# EAGLE design Debug-unit (rev01) (EAGLE 6.6.0)

## Sheet 1 of 2
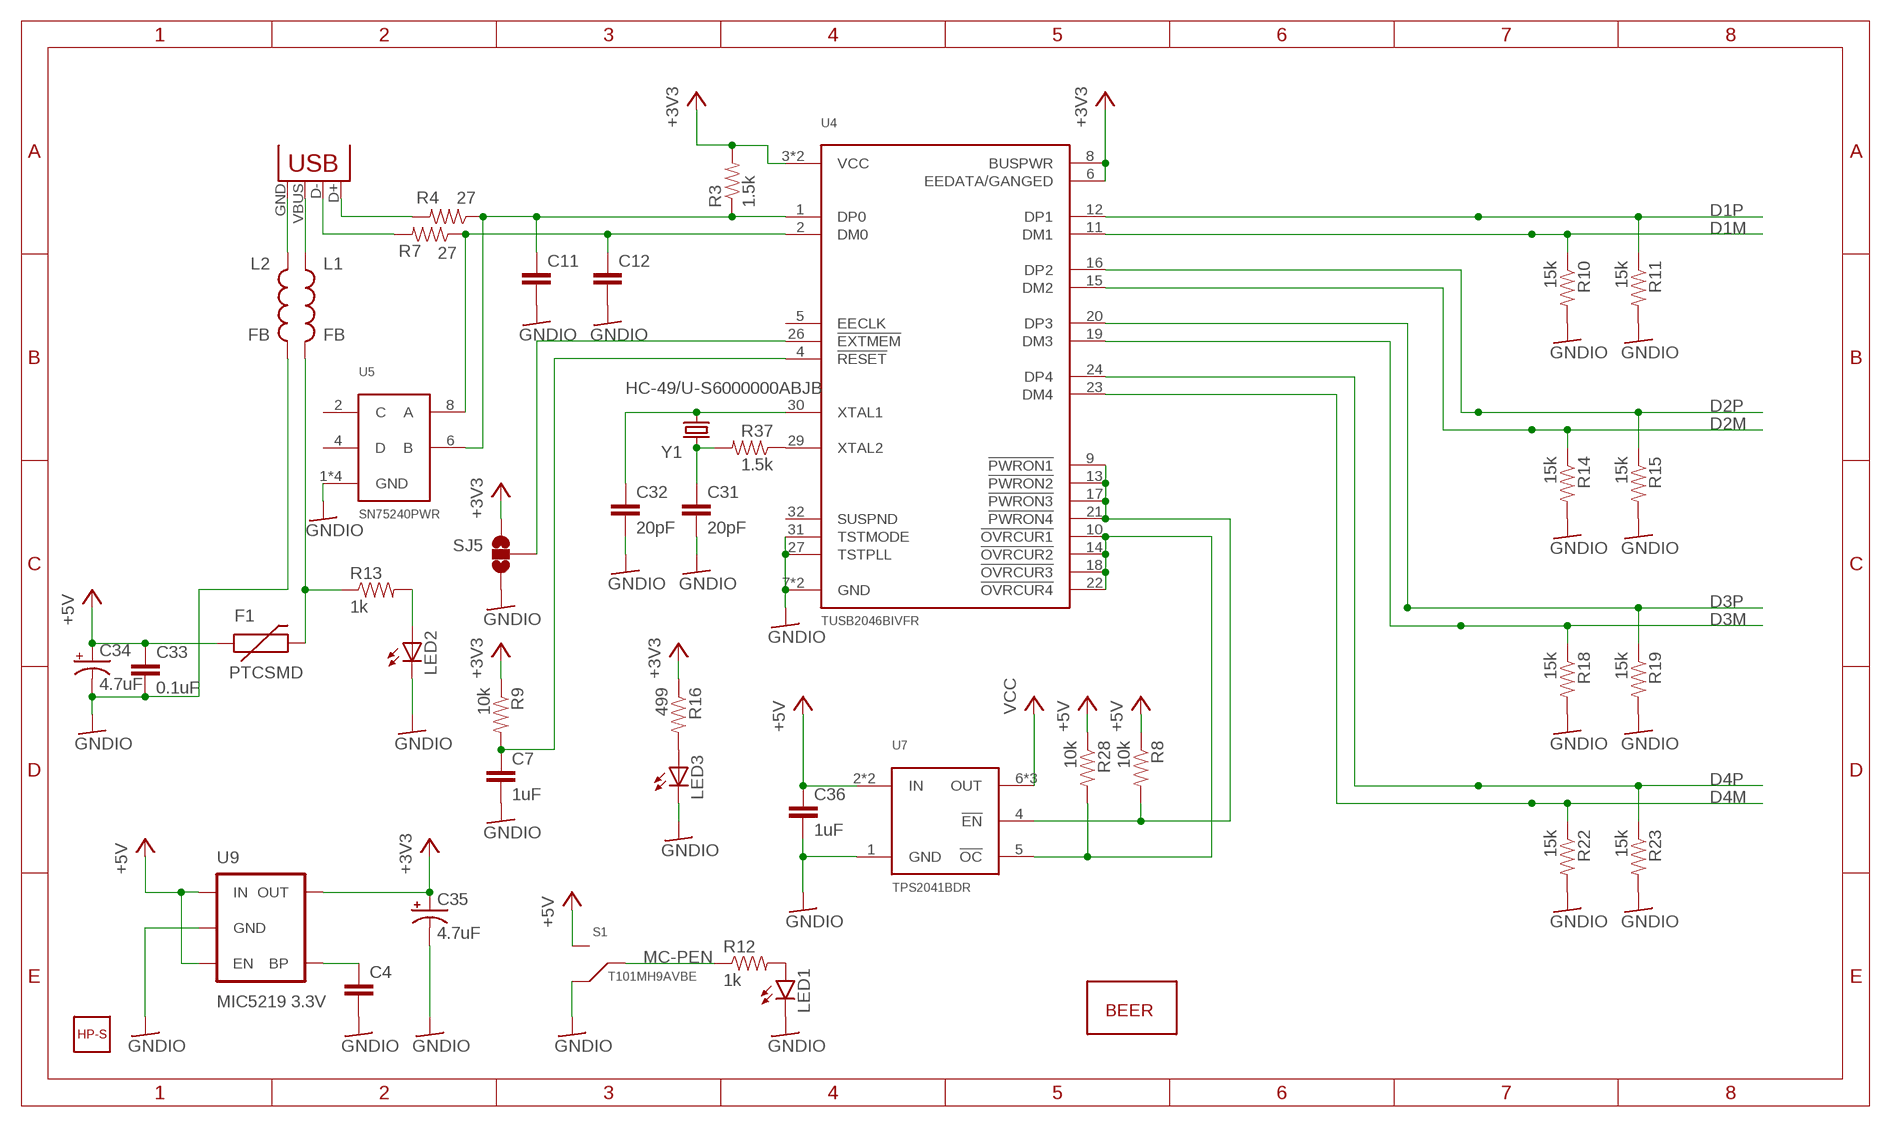
[diagram p0: schematic, sheet 1]

### Parts
C4  CAP0805  [0805]
C7  1uF  CAP0805  [0805]
C11  CAP0805  [0805]
C12  CAP0805  [0805]
C31  20pF  CAP0805  [0805]
C32  20pF  CAP0805  [0805]
C33  0.1uF  CAP0805  [0805]
C34  4.7uF  CAP_POL1206  [EIA3216]
C35  4.7uF  CAP_POL1206  [EIA3216]
C36  1uF  CAP0805  [0805]
F1  PTCSMD  [PTC-1206]
JP9  USB-B  USBPTH  [USB-B-PTH]
L1  FB  INDUCTOR0805  [0805]
L2  FB  INDUCTOR0805  [0805]
LED1  LED-3MM-NO_SILK  [LED3MM-NS]
LED2  LEDCHIP-LED0805  [CHIP-LED0805]
LED3  LEDCHIP-LED0805  [CHIP-LED0805]
R3  1.5k  RESISTOR0805-RES  [0805]
R4  27  RESISTOR0805-RES  [0805]
R7  27  RESISTOR0805-RES  [0805]
R8  10k  RESISTOR0805-RES  [0805]
R9  10k  RESISTOR0805-RES  [0805]
R10  15k  RESISTOR0805-RES  [0805]
R11  15k  RESISTOR0805-RES  [0805]
R12  1k  RESISTOR0805-RES  [0805]
R13  1k  RESISTOR0805-RES  [0805]
R14  15k  RESISTOR0805-RES  [0805]
R15  15k  RESISTOR0805-RES  [0805]
R16  499  RESISTOR0805-RES  [0805]
R18  15k  RESISTOR0805-RES  [0805]
R19  15k  RESISTOR0805-RES  [0805]
R22  15k  RESISTOR0805-RES  [0805]
R23  15k  RESISTOR0805-RES  [0805]
R28  10k  RESISTOR0805-RES  [0805]
R37  1.5k  RESISTOR0805-RES  [0805]
S1  T101MH9AVBE  [T101MH9AVBE]
SJ5  JUMPER-PAD-3-NOFULL_BOX_SILK  [PAD-JUMPER-3-NO_YES_SILK_FULL_BOX]
U4  TUSB2046BIVFR  [LQFP-32]
U5  SN75240PWR  [TSSOP-8]
U7  TPS2041BDR  [SO-8]
U9  MIC5219 3.3V  V_REG_MIC52193.3V  [SOT23-5]
U$1  HP-3651-B  [HP-3651-B]
U$3  BEERS  [B-S]
Y1  HC-49/U-S6000000ABJB  CRYSTALHC49US  [HC49US]

### Nets
+3V3: C35.A(+) R3.2 R9.1 R16.1 SJ5.1 U4.3(VCC) U4.6(EEDATA/GANGED) U4.8(BUSPWR) U4.25(VCC) U9.5(OUT)
+5V: C33.1 C34.A(+) C36.1 F1.1 R8.1 R28.1 S1.1(NO) U7.2(IN) U7.3(IN) U9.1(IN) U9.3(EN)
D1M: R10.1 U4.11(DM1) ; also sheet 2
D1P: R11.1 U4.12(DP1) ; also sheet 2
D2M: R14.1 U4.15(DM2) ; also sheet 2
D2P: R15.1 U4.16(DP2) ; also sheet 2
D3M: R18.1 U4.19(DM3) ; also sheet 2
D3P: R19.1 U4.20(DP3) ; also sheet 2
D4M: R22.1 U4.23(DM4) ; also sheet 2
D4P: R23.1 U4.24(DP4) ; also sheet 2
GNDIO: C4.2 C7.2 C11.2 C12.2 C31.2 C32.2 C33.2 C34.C(-) C35.C(-) C36.2 L2.2 LED1.K(C) LED2.C LED3.C R10.2 R11.2 R14.2 R15.2 R18.2 R19.2 R22.2 R23.2 S1.3(NC) SJ5.3 U4.7(GND) U4.27(TSTPLL) U4.28(GND) U4.31(TSTMODE) U5.1(GND) U5.3(GND) U5.5(GND) U5.7(GND) U7.1(GND) U9.2(GND) ; also sheet 2
MC-PEN: R12.1 S1.2(C) ; also sheet 2
N$7: C4.1 U9.4(BP)
N$11: R8.2 U4.9(!PWRON1) U4.13(!PWRON2) U4.17(!PWRON3) U4.21(!PWRON4) U7.4(!EN)
N$13: LED2.A R13.2
N$25: LED3.A R16.2
N$28: R28.2 U4.10(!OVRCUR1) U4.14(!OVRCUR2) U4.18(!OVRCUR3) U4.22(!OVRCUR4) U7.5(!OC)
N$38: R37.1 U4.29(XTAL2)
N$39: C31.1 R37.2 Y1.2
N$40: C32.1 U4.30(XTAL1) Y1.1
N$41: C11.1 R3.1 R4.1 U4.1(DP0) U5.6(B)
N$42: SJ5.2 U4.26(!EXTMEM)
N$43: C12.1 R7.1 U4.2(DM0) U5.8(A)
N$44: JP9.D+ R4.2
N$45: JP9.D- R7.2
N$46: C7.1 R9.2 U4.4(!RESET)
N$49: JP9.VBUS L1.1
N$50: JP9.GND L2.1
N$51: F1.2 L1.2 R13.1
N$52: LED1.A R12.2
VCC: U7.6(OUT) U7.7(OUT) U7.8(OUT) ; also sheet 2
Unconnected: U4.5(EECLK) U4.32(SUSPND) U5.2(C) U5.4(D)

## Sheet 2 of 2
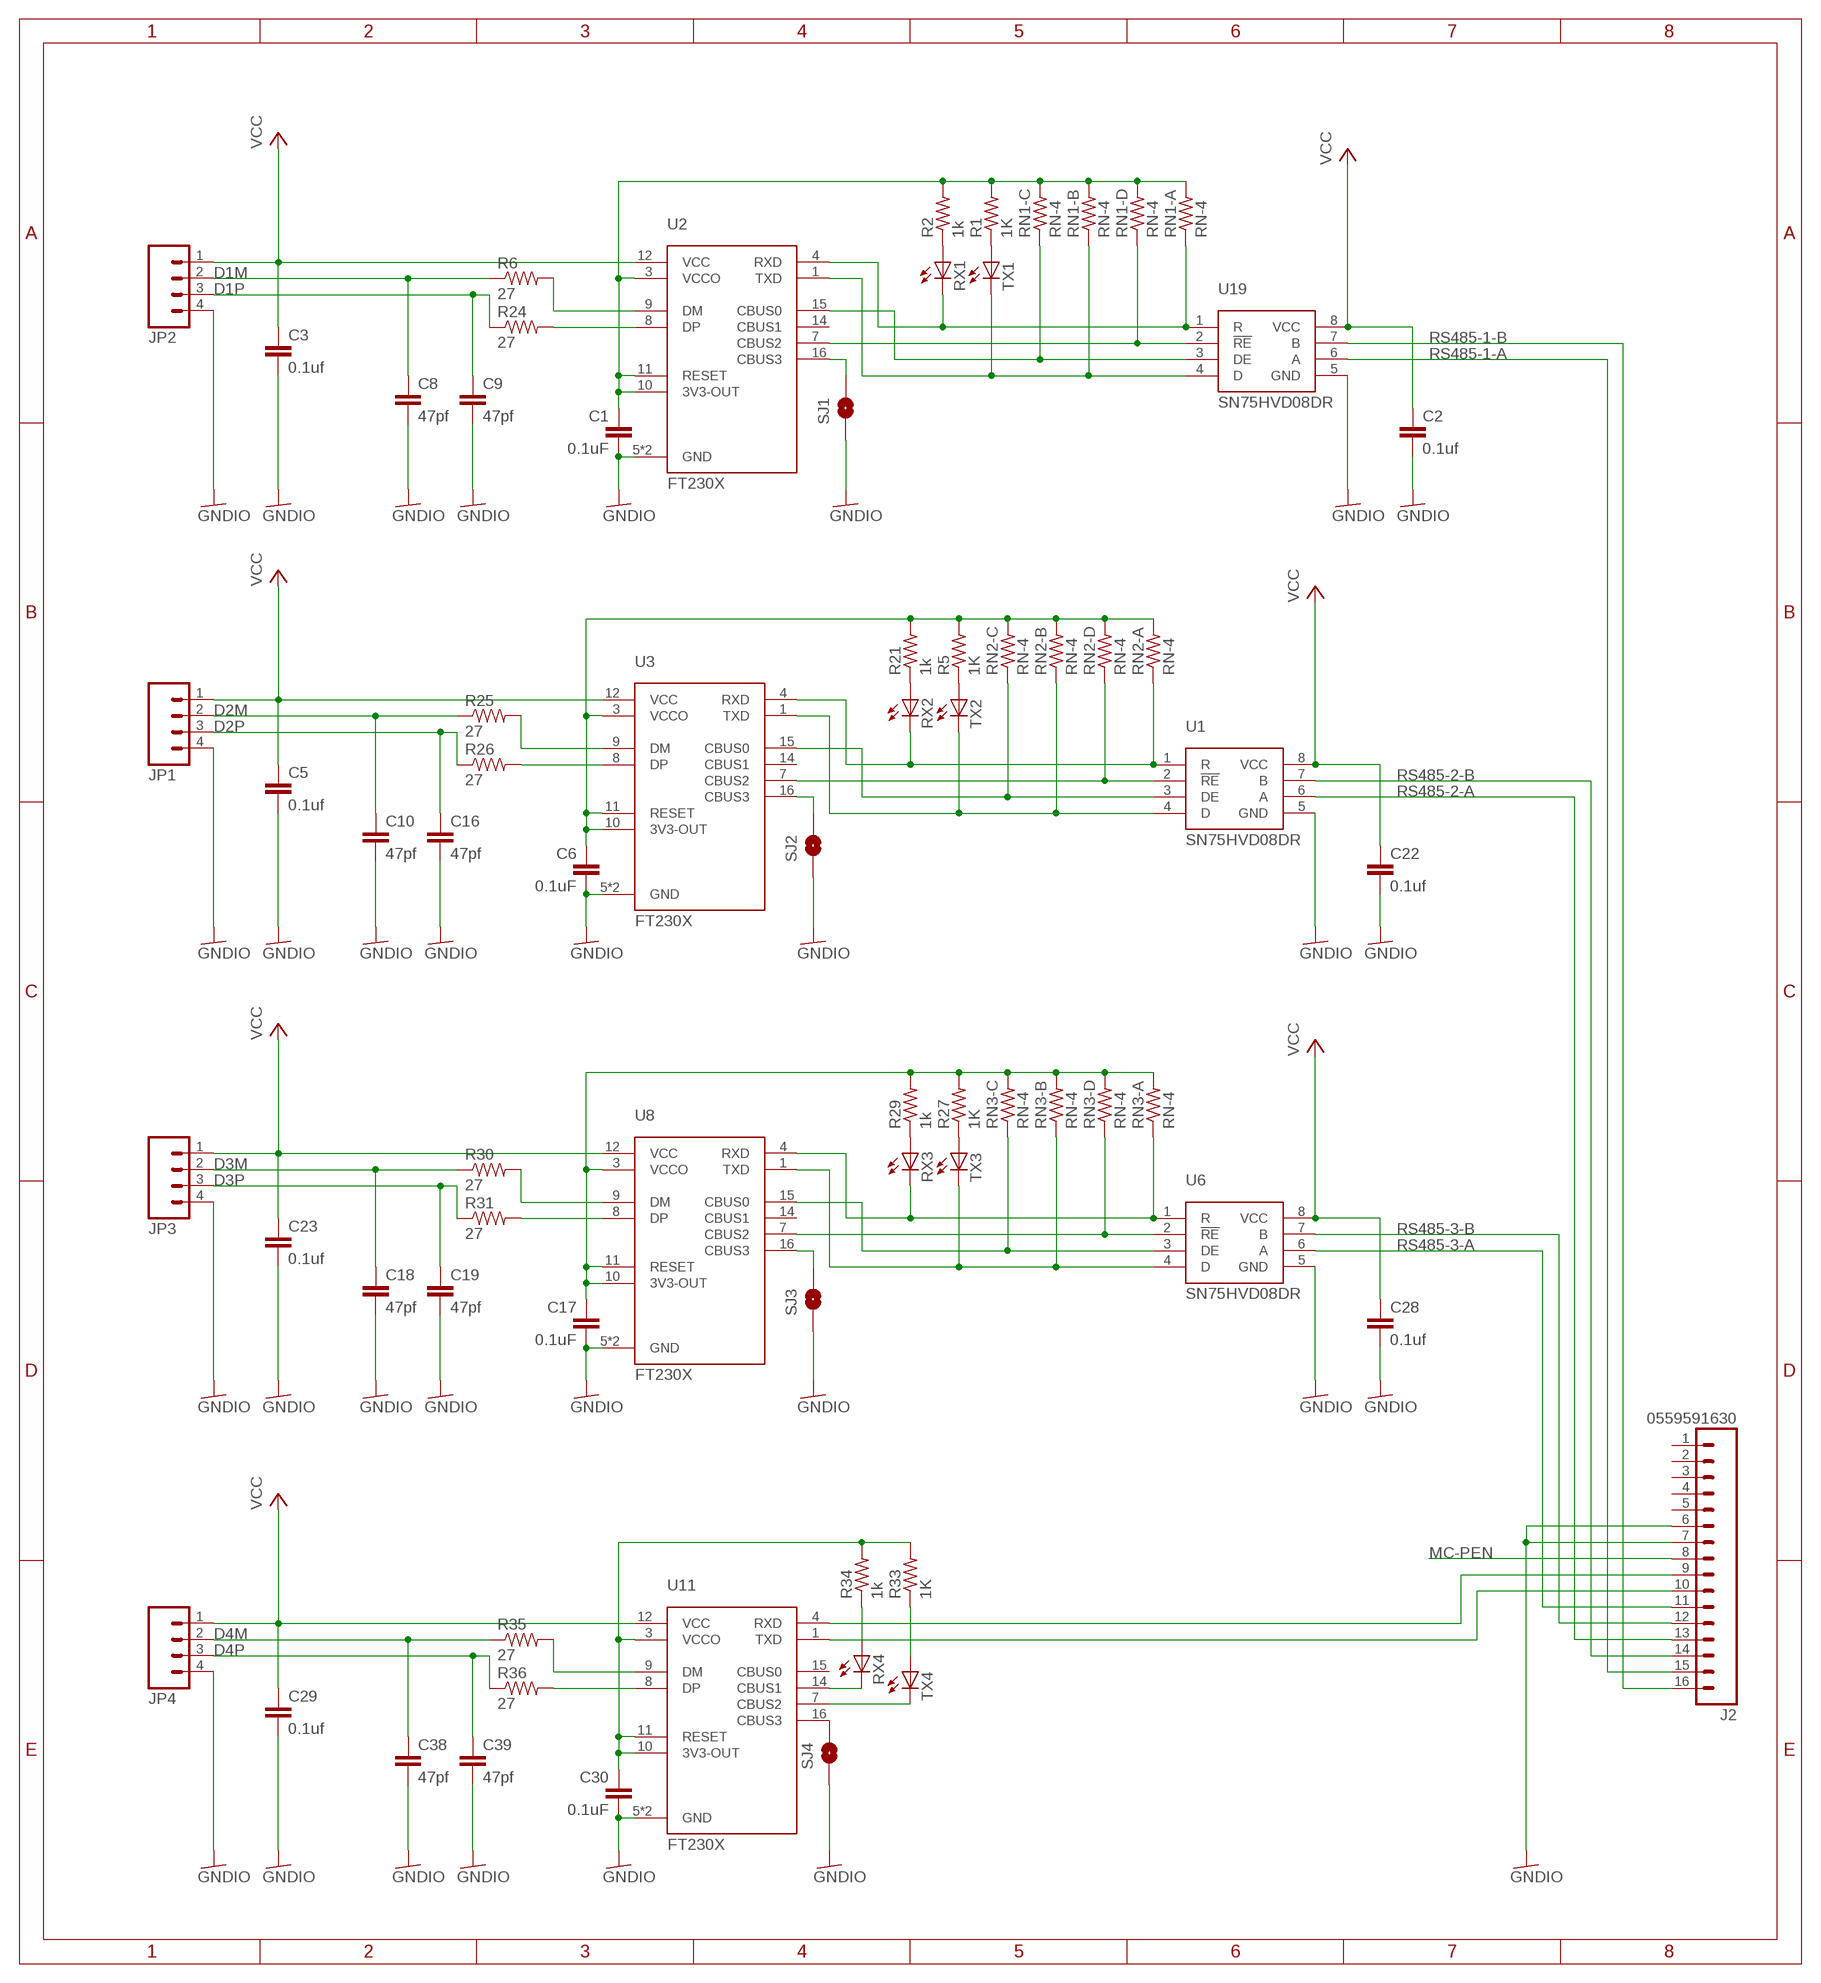
[diagram p1: schematic, sheet 2]

### Parts
C1  0.1uF  CAP0805  [0805]
C2  0.1uf  CAP0805  [0805]
C3  0.1uf  CAP0805  [0805]
C5  0.1uf  CAP0805  [0805]
C6  0.1uF  CAP0805  [0805]
C8  47pf  CAP0805  [0805]
C9  47pf  CAP0805  [0805]
C10  47pf  CAP0805  [0805]
C16  47pf  CAP0805  [0805]
C17  0.1uF  CAP0805  [0805]
C18  47pf  CAP0805  [0805]
C19  47pf  CAP0805  [0805]
C22  0.1uf  CAP0805  [0805]
C23  0.1uf  CAP0805  [0805]
C28  0.1uf  CAP0805  [0805]
C29  0.1uf  CAP0805  [0805]
C30  0.1uF  CAP0805  [0805]
C38  47pf  CAP0805  [0805]
C39  47pf  CAP0805  [0805]
J2  0559591630  [0559591630]
JP1  M04POLAR_LOCK  [MOLEX-1X4_LOCK]
JP2  M04POLAR_LOCK  [MOLEX-1X4_LOCK]
JP3  M04POLAR_LOCK  [MOLEX-1X4_LOCK]
JP4  M04POLAR_LOCK  [MOLEX-1X4_LOCK]
R1  1K  R-US_R0805  [R0805]
R2  1k  R-US_R0805  [R0805]
R5  1K  R-US_R0805  [R0805]
R6  27  RESISTOR0805-RES  [0805]
R21  1k  R-US_R0805  [R0805]
R24  27  RESISTOR0805-RES  [0805]
R25  27  RESISTOR0805-RES  [0805]
R26  27  RESISTOR0805-RES  [0805]
R27  1K  R-US_R0805  [R0805]
R29  1k  R-US_R0805  [R0805]
R30  27  RESISTOR0805-RES  [0805]
R31  27  RESISTOR0805-RES  [0805]
R33  1K  R-US_R0805  [R0805]
R34  1k  R-US_R0805  [R0805]
R35  27  RESISTOR0805-RES  [0805]
R36  27  RESISTOR0805-RES  [0805]
RN1  RN-4  [CRA06S]
RN2  RN-4  [CRA06S]
RN3  RN-4  [CRA06S]
RX1  LEDCHIPLED_0805  [CHIPLED_0805]
RX2  LEDCHIPLED_0805  [CHIPLED_0805]
RX3  LEDCHIPLED_0805  [CHIPLED_0805]
RX4  LEDCHIPLED_0805  [CHIPLED_0805]
SJ1  JUMPER-PAD-2-NOYES_SILK  [PAD-JUMPER-2-NO_YES_SILK]
SJ2  JUMPER-PAD-2-NOYES_SILK  [PAD-JUMPER-2-NO_YES_SILK]
SJ3  JUMPER-PAD-2-NOYES_SILK  [PAD-JUMPER-2-NO_YES_SILK]
SJ4  JUMPER-PAD-2-NOYES_SILK  [PAD-JUMPER-2-NO_YES_SILK]
TX1  LEDCHIPLED_0805  [CHIPLED_0805]
TX2  LEDCHIPLED_0805  [CHIPLED_0805]
TX3  LEDCHIPLED_0805  [CHIPLED_0805]
TX4  LEDCHIPLED_0805  [CHIPLED_0805]
U1  SN75HVD08DR  [SO-8]
U2  FT230X  [SSOP-16]
U3  FT230X  [SSOP-16]
U6  SN75HVD08DR  [SO-8]
U8  FT230X  [SSOP-16]
U11  FT230X  [SSOP-16]
U19  SN75HVD08DR  [SO-8]

### Nets
3V: C1.1 R1.2 R2.2 RN1.5 RN1.6 RN1.7 RN1.8 U2.3(VCCO) U2.10(3V3-OUT) U2.11(RESET)
3V1: C6.1 R5.2 R21.2 RN2.5 RN2.6 RN2.7 RN2.8 U3.3(VCCO) U3.10(3V3-OUT) U3.11(RESET)
3V2: C17.1 R27.2 R29.2 RN3.5 RN3.6 RN3.7 RN3.8 U8.3(VCCO) U8.10(3V3-OUT) U8.11(RESET)
3V3: C30.1 R33.2 R34.2 U11.3(VCCO) U11.10(3V3-OUT) U11.11(RESET)
D1M: C8.1 JP2.2 R6.1 ; also sheet 1
D1P: C9.1 JP2.3 R24.1 ; also sheet 1
D2M: C10.1 JP1.2 R25.1 ; also sheet 1
D2P: C16.1 JP1.3 R26.1 ; also sheet 1
D3M: C18.1 JP3.2 R30.1 ; also sheet 1
D3P: C19.1 JP3.3 R31.1 ; also sheet 1
D4M: C38.1 JP4.2 R35.1 ; also sheet 1
D4P: C39.1 JP4.3 R36.1 ; also sheet 1
GNDIO: C1.2 C2.2 C3.2 C5.2 C6.2 C8.2 C9.2 C10.2 C16.2 C17.2 C18.2 C19.2 C22.2 C23.2 C28.2 C29.2 C30.2 C38.2 C39.2 J2.6 J2.7 JP1.4 JP2.4 JP3.4 JP4.4 SJ1.1 SJ2.1 SJ3.1 SJ4.1 U1.5(GND) U2.5(GND) U2.13(GND) U3.5(GND) U3.13(GND) U6.5(GND) U8.5(GND) U8.13(GND) U11.5(GND) U11.13(GND) U19.5(GND) ; also sheet 1
MC-PEN: J2.8 ; also sheet 1
N$1: R1.1 TX1.A
N$2: R2.1 RX1.A
N$3: SJ1.2 U2.16(CBUS3)
N$4: R5.1 TX2.A
N$5: RN1.4 U2.7(CBUS2) U19.2(!RE)
N$6: RN1.3 U2.15(CBUS0) U19.3(DE)
N$8: R6.2 U2.9(DM)
N$9: R24.2 U2.8(DP)
N$10: R21.1 RX2.A
N$12: R25.2 U3.9(DM)
N$14: R26.2 U3.8(DP)
N$15: RN2.4 U1.2(!RE) U3.7(CBUS2)
N$16: RN2.3 U1.3(DE) U3.15(CBUS0)
N$17: SJ2.2 U3.16(CBUS3)
N$18: R27.1 TX3.A
N$19: R29.1 RX3.A
N$20: R30.2 U8.9(DM)
N$21: R31.2 U8.8(DP)
N$22: RN3.4 U6.2(!RE) U8.7(CBUS2)
N$23: RN3.3 U6.3(DE) U8.15(CBUS0)
N$24: SJ3.2 U8.16(CBUS3)
N$31: R33.1 TX4.A
N$32: R34.1 RX4.A
N$33: TX4.C U11.7(CBUS2)
N$34: RX4.C U11.14(CBUS1)
N$35: R35.2 U11.9(DM)
N$36: R36.2 U11.8(DP)
N$37: SJ4.2 U11.16(CBUS3)
N$47: J2.10 U11.1(TXD)
N$48: J2.9 U11.4(RXD)
RS485-1-A: J2.15 U19.6(A)
RS485-1-B: J2.16 U19.7(B)
RS485-2-A: J2.13 U1.6(A)
RS485-2-B: J2.14 U1.7(B)
RS485-3-A: J2.11 U6.6(A)
RS485-3-B: J2.12 U6.7(B)
RXD0: RN1.1 RX1.C U2.4(RXD) U19.1(R)
RXD1: RN2.1 RX2.C U1.1(R) U3.4(RXD)
RXD2: RN3.1 RX3.C U6.1(R) U8.4(RXD)
TXD0: RN1.2 TX1.C U2.1(TXD) U19.4(D)
TXD1: RN2.2 TX2.C U1.4(D) U3.1(TXD)
TXD2: RN3.2 TX3.C U6.4(D) U8.1(TXD)
VCC: C2.1 C3.1 C5.1 C22.1 C23.1 C28.1 C29.1 JP1.1 JP2.1 JP3.1 JP4.1 U1.8(VCC) U2.12(VCC) U3.12(VCC) U6.8(VCC) U8.12(VCC) U11.12(VCC) U19.8(VCC) ; also sheet 1
Unconnected: J2.1 J2.2 J2.3 J2.4 J2.5 U2.14(CBUS1) U3.14(CBUS1) U8.14(CBUS1) U11.15(CBUS0)

## Library data of the parts
C1-C3 C5 C6 C8-C10 C16-C19 C22 C23 C28-C30 C38 C39 = SparkFun:CAP: Capacitor Standard 0603 ceramic capacitor, and 0.1" leaded capacitor.
C4 C7 C11 C12 C31-C33 C36 = SparkFun-Passives:CAP: Capacitor Standard 0603 ceramic capacitor, and 0.1" leaded capacitor.
C34 C35 = SparkFun-Capacitors:CAP_POL: Capacitor Polarized These are standard SMD and PTH capacitors. Normally 10uF, 47uF, and 100uF in electrolytic and tantalum varieties. Always verify the external diameter of the through hole cap, it varies with capacity, voltage, and manufacturer. The EIA devices should be standard.
F1 = SparkFun-PowerIC:PTC: Resettable Fuse PTC Resettable Fuse. Spark Fun Electronics SKU : COM-08357; PROD_ID: RES-11150
J2 = NASA_LIB:0559591630
JP1-JP4 = SparkFun-Connectors:M04: Header 4 Standard 4-pin 0.1" header. Use with straight break away headers (SKU : PRT-00116), right angle break away headers (PRT-00553), swiss pins (PRT-00743), machine pins (PRT-00117), and female headers (PRT-00115). Molex polarized connector foot print use with SKU : PRT-08231 with associated crimp pins and housings. 1MM SMD Version SKU: PRT-10208
JP9 = SparkFun-Connectors:USB: USB Connectors USB-B-PTH is fully proven SKU : PRT-00139/CONN-08278 USB-miniB is fully proven SKU : PRT-00587 USB-A-PCB is untested. USB-A-H is throughly reviewed, but untested. Spark Fun Electronics SKU : PRT-00437 USB-B-SMT is throughly reviewed, but untested. Needs silkscreen touching up. USB-A-S has not been used/tested USB-MB-H has not been used/tested USB-MICROB has been used. CONN-09505; PROD_ID: CONN-08278
L1 L2 = SparkFun-Passives:INDUCTOR: Inductors Basic Inductor/Choke - 0603 and 1206. Footprints are not proven and vary greatly between part numbers. SRN6045- 33uH, 20% 1.4A SDR0403-560KL - 56uH, 10%, 500mA RMS/740mA peak
LED1 = SparkFun-LED:LED: LEDs Standard schematic elements and footprints for 5mm, 3mm, 1206, and 0603 sized LEDs. 5mm - Spark Fun Electronics SKU : COM-00529 (and others)
LED2 LED3 RX1-RX4 TX1-TX4 = adafruit:LED: LED OSRAM: - CHIPLED LG R971, LG N971, LY N971, LG Q971, LY Q971, LO R971, LY R971 LH N974, LH R974 LS Q976, LO Q976, LY Q976 LO Q996 - Hyper CHIPLED LW Q18S LB Q993, LB Q99A, LB R99A - SideLED LS A670, LO A670, LY A670, LG A670, LP A670 LB A673, LV A673, LT A673, LW A673 LH A674 LY A675 LS A676, LA A676, LO A676, LY A676, LW A676 LS A679, LY A679, LG A679 - Hyper Micro SIDELED® LS Y876, LA Y876, LO Y876, LY Y876 LT Y87S - SmartLED LW L88C, LW L88S LB L89C, LB L89S, LG L890 LS L89K, LO L89K, LY L89K LS L896, LA L896, LO L896, LY L896 - TOPLED LS T670, LO T670, LY T670, LG T670, LP T670 LSG T670, LSP T670, LSY T670, LOP T670, LYG T670 LG T671, LOG T671, LSG T671 LB T673, LV T673, LT T673, LW T673 LH T674 LS T676, LA T676, LO T676, LY T676, LB T676, LH T676, LSB T676, LW T676 LB T67C, LV T67C, LT T67C, LS T67K, LO T67K, LY T67K, LW E67C LS E67B, LA E67B, LO E67B, LY E67B, LB E67C, LV E67C, LT E67C LW T67C LS T679, LY T679, LG T679 LS T770, LO T770, LY T770, LG T770, LP T770 LB T773, LV T773, LT T773, LW T773 LH T774 LS E675, LA E675, LY E675, LS T675 LS T776, LA T776, LO T776, LY T776, LB T776 LHGB T686 LT T68C, LB T68C - Hyper Mini TOPLED® LB M676 - Mini TOPLED Santana® LG M470 LS M47K, LO M47K, LY M47K Source: http://www.osram.convergy.de/
R1 R2 R5 R21 R27 R29 R33 R34 = adafruit:R-US_: RESISTOR, American symbol
R3 R4 R6-R16 R18 R19 R22-R26 R28 R30 R31 R35-R37 = SparkFun-Passives:RESISTOR: Resistor Basic schematic elements and footprints for 0603, 1206, and PTH resistors.
RN1-RN3 = DFT2:RN-4
S1 = FSAE Eletric:T101MH9AVBE
SJ1-SJ4 = SparkFun-Passives:JUMPER-PAD-2-NO
SJ5 = SparkFun-Passives:JUMPER-PAD-3-NO
U1 U6 U19 = FSAE Eletric:SN75HVD08DR
U2 U3 U8 U11 = FSAE Eletric:FT230X
U4 = FSAE Eletric:TUSB2046BIVFR
U5 = FSAE Eletric:SN75240PWR
U7 = FSAE Eletric:TPS2041BDR
U9 = SparkFun-PowerIC:V_REG_MIC5219: V_REG MIC5219 Standard 500mA LDO voltage regulator in SOT-23 layout. Micrel part MIC5219. BP (by-pass) pin is used to lower output noise with 470pF cap, may be left open.; PROD_ID: VREG-09872
U$1 = FSAE Eletric:HP-3651-B
U$3 = Pic:BEER
Y1 = SparkFun-FreqCtrl:CRYSTAL: Various standard crystals. Proven footprints. Spark Fun Electronics SKU : COM-00534

## Board
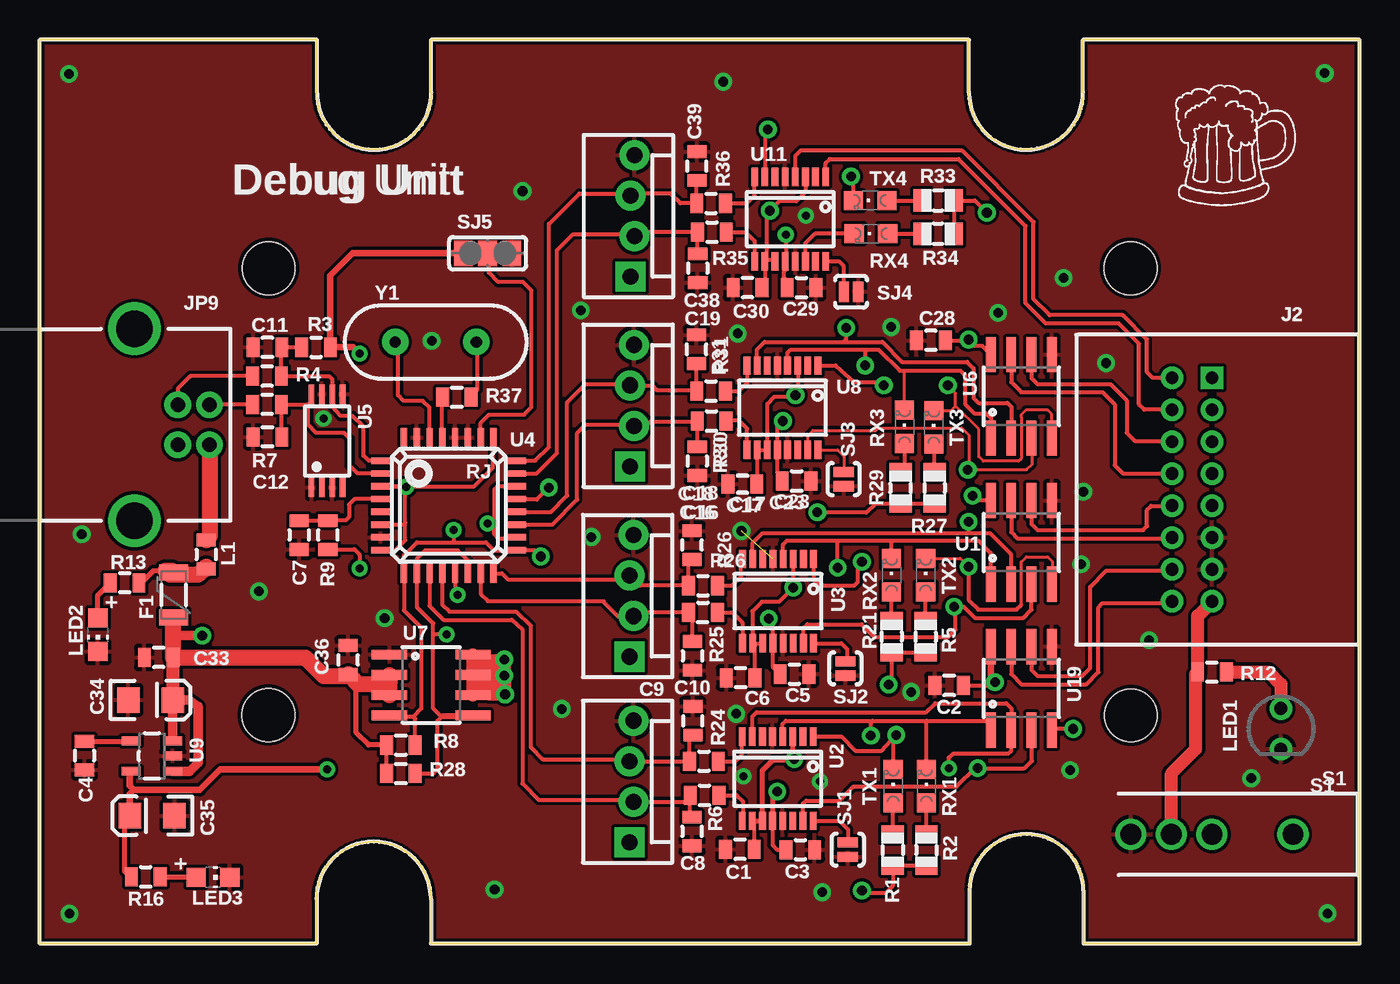
[diagram p2: board, top side]
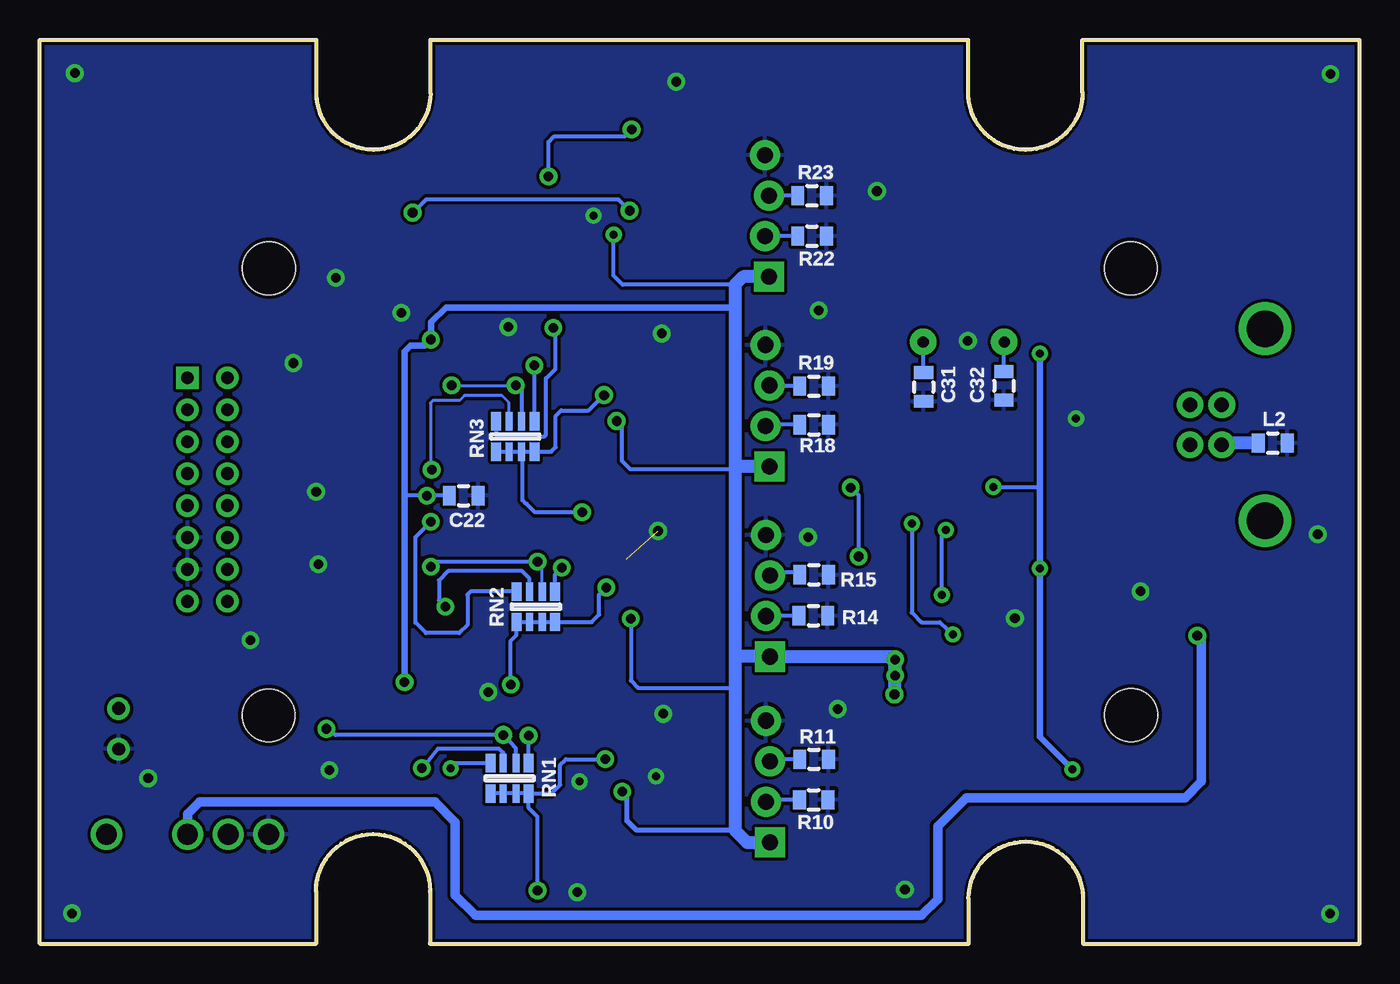
[diagram p3: board, bottom side, seen from below]

Size 82.65 x 56.62 mm. Coordinates in mm from the lower left corner, seen from the top.
Copper layers (1*16): Top 0.035mm / dielectric 1.5mm / Bottom 0.035mm
Design rules "SparkFun": minimum track width 8mil, minimum drill 20mil, track to track 8mil, track to pad 8mil, pad to pad 8mil, via to via 8mil, smd to smd 8mil, copper to edge 10mil, drill to drill 8mil, minimum pad ring 12mil, minimum via ring 10mil, stop-mask expansion 4mil, vias tented up to drill 25mil, thermal gap 10mil

### Footprints (pad centres in the part's own frame; a part is rotated, then mirrored left to right if it is on the bottom)
0805 = smd 0.8 x 1.2: 1 -0.9,0; 2 0.9,0
EIA3216 = smd 1.4 x 1.6: A 1.4,0; C -1.4,0
PTC-1206 = smd 1 x 1.8: 1 -1.4,0; 2 1.4,0
0559591630 = drill 0.8 square: 1 -7,0 | drill 0.8: 2 -5,0; 3 -3,0; 4 -1,0; 5 1,0; 6 3,0; 7 5,0; 8 7,0; 9 -7,-2.5; 10 -5,-2.5; 11 -3,-2.5; 12 -1,-2.5; 13 1,-2.5; 14 3,-2.5; 15 5,-2.5; 16 7,-2.5
MOLEX-1X4_LOCK = drill 1.016 pad 1.88 square: 1 0,0.127 | drill 1.016 pad 1.88: 2 2.54,-0.127; 3 5.08,0.127; 4 7.62,-0.127
USB-B-PTH = drill 0.914 pad 1.676: D+ 0,1.25; D- 1.981,1.25; GND 0,-1.25; VBUS 1.981,-1.25 | drill 2.286: S1 -2.718,-6.02; S2 -2.718,6.02
LED3MM-NS = drill 0.813: A -1.27,0; K 1.27,0
CHIP-LED0805 = smd 1.2 x 1.2: A 0,-1.05; C 0,1.05
R0805 = smd 1.1 x 1.4: 1 -1,0; 2 1,0
CRA06S = smd 0.63 x 1.15: 1 -1.2,-1; 4 1.2,-1; 5 1.2,0.9; 8 -1.2,0.9 | smd 0.44 x 1.15: 2 -0.4,-1; 3 0.4,-1; 6 0.4,0.9; 7 -0.4,0.9
CHIPLED_0805 = smd 1.2 x 1.2: A 0,-1.05; C 0,1.05
T101MH9AVBE = drill 1.3: 1 0,0; 2 0,2.54; 3 0,5.08; P$4 0,-5.08
PAD-JUMPER-2-NO_YES_SILK = smd 0.635 x 1.27: 1 -0.45,0; 2 0.45,0
PAD-JUMPER-3-NO_YES_SILK_FULL_BOX = smd 1.168 x 1.6: 1 -1.524,0; 2 0,0; 3 1.524,0
SO-8 = smd 0.61 x 2.21: 1 -1.905,-2.616; 2 -0.635,-2.616; 3 0.635,-2.616; 4 1.905,-2.616; 5 1.905,2.616; 6 0.635,2.616; 7 -0.635,2.616; 8 -1.905,2.616
SSOP-16 = smd 0.419 x 1.143: 1 -2.223,-2.642; 2 -1.587,-2.642; 3 -0.953,-2.642; 4 -0.318,-2.642; 5 0.318,-2.642; 6 0.953,-2.642; 7 1.587,-2.642; 8 2.223,-2.642; 9 2.223,2.642; 10 1.587,2.642; 11 0.953,2.642; 12 0.318,2.642; 13 -0.318,2.642; 14 -0.953,2.642; 15 -1.587,2.642; 16 -2.223,2.642
LQFP-32 = smd 0.4 x 1.2: 1 -2.8,-4.25; 2 -2,-4.25; 3 -1.2,-4.25; 4 -0.4,-4.25; 5 0.4,-4.25; 6 1.2,-4.25; 7 2,-4.25; 8 2.8,-4.25; 17 2.8,4.25; 18 2,4.25; 19 1.2,4.25; 20 0.4,4.25; 21 -0.4,4.25; 22 -1.2,4.25; 23 -2,4.25; 24 -2.8,4.25 | smd 1.2 x 0.4: 9 4.25,-2.8; 10 4.25,-2; 11 4.25,-1.2; 12 4.25,-0.4; 13 4.25,0.4; 14 4.25,1.2; 15 4.25,2; 16 4.25,2.8; 25 -4.25,2.8; 26 -4.25,2; 27 -4.25,1.2; 28 -4.25,0.4; 29 -4.25,-0.4; 30 -4.25,-1.2; 31 -4.25,-2; 32 -4.25,-2.8
TSSOP-8 = smd 1.2 x 0.35: 1 -2.925,0.975; 2 -2.925,0.325; 3 -2.925,-0.325; 4 -2.925,-0.975; 5 2.925,-0.975; 6 2.925,-0.325; 7 2.925,0.325; 8 2.925,0.975
SOT23-5 = smd 0.55 x 1.2: 1 -0.95,-1.3; 2 0,-1.3; 3 0.95,-1.3; 4 0.95,1.3; 5 -0.95,1.3
HP-3651-B = hole 3.302: 14.326,-14.3; 42.316,-14.326; 14.3,-68.326; 42.316,-68.301
HC49US = drill 0.7 pad 1.651: 1 -2.54,0; 2 2.54,0

### Placement (x,y rotation side)
C1  43.84,5.92 180 top
C2  56.95,16.18 180 top
C3  47.62,5.89 0 top
C4  2.79,11.79 270 top
C5  47.27,16.89 0 top
C6  43.89,16.66 180 top
C7  16.23,25.6 270 top
C8  40.84,7.04 270 top
C9  40.89,13.97 90 top
C10  40.87,18.03 270 top
C11  14.25,37.36 180 top
C12  14.25,31.75 180 top
C16  40.84,24.97 90 top
C17  43.99,28.8 180 top
C18  41.17,30.23 270 top
C19  41.12,37.24 90 top
C22  56.11,28.07 0 bottom
C23  47.4,28.98 0 top
C28  55.8,37.8 180 top
C29  47.7,41.1 0 top
C30  44.32,41.1 180 top
C31  27.3,34.87 270 bottom
C32  22.28,34.95 270 bottom
C33  7.44,17.93 180 top
C34  6.93,15.27 0 top
C35  7.04,8.03 180 top
C36  19.3,17.78 90 top
C38  41.2,42.32 270 top
C39  41.15,48.72 90 top
F1  8.38,21.84 90 top
J2  73.41,28.45 270 top
JP1  37.06,17.98 90 top
JP2  37.06,6.35 90 top
JP3  37.08,29.9 90 top
JP4  37.11,41.78 90 top
JP9  8.64,32.51 0 top
L1  10.41,24.38 270 top
L2  5.44,31.37 0 bottom
LED1  77.72,13.46 270 top
LED2  3.63,19.35 180 top
LED3  10.85,4.17 270 top
R1  53.42,5.87 270 top
R2  55.52,5.87 270 top
R3  17.3,37.36 0 top
R4  14.22,35.56 180 top
R5  55.47,19.23 270 top
R6  41.63,9.3 0 top
R7  14.22,33.78 180 top
R8  22.61,12.45 0 top
R9  18.03,25.6 90 top
R10  34.19,9.02 0 bottom
R11  34.16,11.56 0 bottom
R12  73.41,17.02 0 top
R13  5.31,22.61 180 top
R14  34.21,20.55 0 bottom
R15  34.16,23.11 0 bottom
R16  6.63,4.19 0 top
R18  34.16,32.51 0 bottom
R19  34.16,34.92 0 bottom
R21  53.34,19.23 270 top
R22  34.29,44.32 0 bottom
R23  34.29,46.86 0 bottom
R24  41.58,11.43 0 top
R25  41.53,20.75 0 top
R26  41.53,22.43 0 top
R27  56.03,28.55 270 top
R28  22.61,10.67 0 top
R29  53.9,28.55 270 top
R30  42.06,32.74 0 top
R31  42.04,34.62 0 top
R33  56.26,46.56 0 top
R34  56.26,44.48 0 top
R35  42.09,44.58 0 top
R36  42.04,46.38 0 top
R37  26.11,34.24 0 top
RN1  53.24,10.31 180 bottom
RN2  51.59,21.06 180 bottom
RN3  52.88,31.72 180 bottom
RX1  55.52,9.88 0 top
RX2  53.34,23.09 0 top
RX3  54.15,32.38 0 top
RX4  52.04,44.48 90 top
S1  73.41,6.86 90 top
SJ1  50.6,5.89 90 top
SJ2  50.44,17.25 90 top
SJ3  50.34,29.11 90 top
SJ4  50.8,40.84 180 top
SJ5  28.04,43.26 0 top
TX1  53.44,9.88 0 top
TX2  55.47,23.09 0 top
TX3  55.98,32.36 0 top
TX4  51.99,46.56 90 top
U1  61.47,25.15 0 top
U2  46.2,10.34 180 top
U3  46.23,21.46 180 top
U4  25.6,27.46 270 top
U5  17.98,31.5 90 top
U6  61.47,34.29 0 top
U7  24.51,16.21 270 top
U8  46.51,33.58 180 top
U9  7.01,11.76 90 top
U11  46.99,45.39 180 top
U19  61.47,16 0 top
U$1  0,0 90 top
U$3  71.12,46.23 0 top
Y1  24.79,37.69 0 top

### Tracks (layer width: path | path; a pad name or v marks a point on that pad's centre or on a via)
3V  (via drill 0.6)
  Top 0.254: C1.1 44.74,7.57 U2.10 | R2.2 R1.2 53.42,3.63 52.96,3.17 51.64,3.17 v51.49,3.33
  Top 0.305: U2.3 47.17,12.97 47.17,11.66 47.24,11.58 v47.24,11.56 47.22,11.53 45.92,11.53 45.25,10.86 U2.11 U2.10
  Bottom 0.254: v51.49,3.33 51.49,7.95 52.05,8.51 RN1.8 | RN1.8 RN1.7 RN1.6 RN1.5 | RN1.8 50.61,9.41 50.06,9.96 50.06,11.2 49.71,11.56 v47.24,11.56
3V1  (via drill 0.6)
  Top 0.254: U3.10 44.63,18.83 44.63,20.83 45.21,21.41 46.28,21.41 v47.18,22.31 U3.3 | U3.10 U3.11 | C6.1 44.79,18.67 U3.10 | R5.2 R21.2 53.34,16.41 v53.16,16.23
  Bottom 0.254: v47.18,22.31 47.62,21.87 47.62,20.62 48.09,20.16 RN2.8 RN2.7 RN2.6 RN2.5 52.81,20.14 52.81,19.33 53.16,18.97 v53.16,16.23
3V2  (via drill 0.6)
  Top 0.254: C17.1 44.92,29.06 U8.10 U8.11 45.55,33.82 46,34.27 47.22,34.27 v47.32,34.37 47.52,34.57 47.52,36.16 U8.3 | R27.2 R29.2 52.31,27.55 51.77,27 48.72,27 v48.69,27.03
  Bottom 0.254: RN3.5 RN3.6 RN3.7 | RN3.7 RN3.8 50.63,30.82 50.34,31.11 50.34,33.07 50.01,33.4 48.28,33.4 v47.32,34.37 | v48.69,27.03 51.64,27.03 52.17,27.56 52.2,27.56 52.43,27.79 52.43,30.77 RN3.7
3V3  (via drill 0.6)
  Top 0.254: U11.3 47.94,47.08 47.37,46.51 46.3,46.51 45.81,46.01 v45.72,45.92 45.52,45.72 45.52,42.86 | 45.52,42.86 U11.10 45.4,41.28 C30.1 | 45.52,42.86 45.92,42.86 U11.11 | R34.2 R33.2 58.55,46.56 v59.31,45.8
  Bottom 0.254: v59.31,45.8 59.28,45.8 58.45,46.63 46.43,46.63 v45.72,45.92
+3V3  (via drill 0.5)
  Top 0.254: U4.8 22.27,24.66 22.89,25.27 22.89,26.36 | 22.89,26.36 22.89,28.65 | 22.89,28.65 U4.3 22.91,28.66 v22.94,28.63 | 22.89,28.65 27.2,28.65 28.37,29.82 28.37,31.68 U4.25 | U4.6 22.78,26.26 22.89,26.36 | R9.1 19.7,24.7 20.02,24.38 v20.02,23.52
  Top 0.305: R16.1 5.66,4.19 5.31,4.55 5.31,7.7 C35.A
  Top 0.406: SJ5.1 19.58,43.26 18.19,41.86 18.19,37.37 R3.2 19.61,37.36 v20.02,36.96 | v17.98,10.92 11.3,10.92 10.01,9.63 5.87,9.63 | 5.87,9.63 5.61,9.88 5.61,10.71 U9.5 | C35.A 5.64,9.39 5.87,9.63
  Bottom 0.254: v22.94,28.63 20.12,28.63 20.02,28.52
  Bottom 0.406: v20.02,36.96 20.02,28.52 v20.02,23.52 20.02,12.95 v17.98,10.92
+5V  (via drill 0.6)
  Top 0.254: R28.1 R8.1
  Top 0.305: R8.1 20.57,12.45 19.81,13.21 19.81,16 20.07,16.26
  Top 0.61: v10.16,19.3 8.34,19.3 | U9.3 8.31,15.24 C34.A 9.32,15.27 9.91,14.86 9.91,11.33 9.39,10.81 U9.1
  Top 0.813: C34.A C33.1 | 19.19,16.76 C36.1
  Top 1.016: U7.3 U7.2 21.89,16.31 21.84,16.26 20.07,16.26 19.93,16.26 19.42,16.76 | 19.42,16.76 C36.1 | 19.42,16.76 17.78,16.76 16.61,17.93 C33.1 8.34,19.3 8.34,20.4 F1.1
  Bottom 0.61: S1.1 73.41,8.13 72.64,8.89 57.91,8.89 56.64,7.62 56.64,3.05 55.37,1.78 27.43,1.78 26.42,2.79 26.42,7.37 24.64,9.14 10.92,9.14 9.91,10.16 9.91,19.05 v10.16,19.3
D1M
  Top 0.254: U4.11 24.4,21.16 25.27,20.3 29.57,20.3 30.23,19.68 30.23,10.03 31.24,9.02 37.06,9.02 JP2.2 40.63,8.89 40.68,8.94 | R6.1 40.68,8.94 | 40.68,8.94 40.68,8.1 C8.1
  Bottom 0.254: R10.1 37.06,9.02 JP2.2
D1P
  Top 0.254: U4.12 25.2,21.25 25.65,20.8 29.82,20.8 30.73,19.94 30.73,12.32 31.5,11.56 36.8,11.56 JP2.3 R24.1 40.68,12.86 C9.1
  Bottom 0.254: R11.1 36.8,11.56 JP2.3
D2M
  Top 0.254: U4.15 27.6,21.93 28.07,21.46 35.31,21.46 35.31,21.41 36.22,20.5 37.16,20.5 JP1.2 37.72,20.75 R25.1 40.87,20.26 C10.1
  Bottom 0.254: R14.1 37.16,20.55 JP1.2
D2P
  Top 0.254: C16.1 40.63,23.85 R26.1 37.57,22.43 JP1.3 36.7,22.84 29.31,22.84 28.94,23.21 U4.16
  Bottom 0.254: R15.1 35.26,23.11 35.41,23.27 36.73,23.27 JP1.3
D3M
  Top 0.254: U4.19 32.1,26.26 33.66,27.81 33.66,32 34.16,32.51 37.13,32.51 JP3.2 37.97,32.44 38.25,32.72 41.14,32.72 R30.1 C18.1
  Bottom 0.254: R18.1 37.13,32.51 JP3.2
D3P
  Top 0.254: U4.20 32.01,27.06 33.02,28.07 33.02,33.91 34.16,35.05 36.88,35.05 JP3.3 38.35,34.98 38.63,34.7 41.06,34.7 R31.1 41.14,36.32 C19.1
  Bottom 0.254: R19.1 36.91,34.92
  Bottom 0.406: 36.91,34.92 JP3.3
D4M
  Top 0.254: U4.23 31.11,29.46 32.38,30.73 32.38,43.43 33.4,44.45 37.11,44.45 JP4.2 37.49,44.58 R35.1 41.2,44.57 C38.1
  Bottom 0.254: R22.1 JP4.2
D4P
  Top 0.254: U4.24 31.02,30.26 31.88,31.11 31.88,45.09 33.78,46.99 36.85,46.99 JP4.3 37.11,46.99 39.5,46.99 40.11,46.38 R36.1 41.14,47.81 C39.1
  Bottom 0.254: R23.1 JP4.3
GNDIO  (via drill 0.5, 0.6)  (1 unrouted)
  other vias: 1.85,1.88 80.47,54.53 80.64,1.91 49,3.23 1.83,54.48 42.8,54 2.62,25.65 28.47,3.4 17.75,32.89 47.98,45.62 48.84,10.16 44.07,10.49 53.31,38.63 43.71,38.23 60.02,39.52 33.88,39.67 54.56,15.77 43.94,25.86 43.61,14.4 65.2,23.77 65.35,28.32 66.78,36.37 69.47,19.02 64.52,10.87 75.87,10.36 64.11,41.71 13.72,22.07 21.59,20.4 24.54,37.77 30.23,47.14 32.69,14.71 34.54,25.48
  pour Bottom: 0,56.64 82.8,56.64 82.8,0 0,0
  pour Top: 0,56.64 82.8,56.64 82.8,0 0,0
MC-PEN
  Top 0.813: S1.2 70.87,10.67 72.39,12.19 72.39,16.9 R12.1 72.51,20.55 J2.8
N$1
  Top 0.254: R1.1 53.42,8.8 TX1.A
N$2
  Top 0.254: R2.1 RX1.A
N$3
  Top 0.254: U2.16 50.09,7.7 50.62,7.16 50.62,6.37 SJ1.2
N$4
  Top 0.254: R5.1 TX2.A
N$5  (via drill 0.5)
  Top 0.254: U2.7 44.62,14.24 44.88,14.5 55.5,14.5 56.08,15.06 60.53,15.06 60.86,14.73 60.86,13.41 U19.2 60.83,12.09 60.66,11.91 57.23,11.91 56.92,11.66 v56.92,11
  Bottom 0.254: RN1.4 56.61,11.31 v56.92,11
N$6  (via drill 0.6)
  Top 0.254: U19.3 62.13,13.36 62.13,11.46 61.67,11 v58.73,11 58.6,11 58.12,10.54 57.91,10.36 57.4,9.86 50.95,9.86 50.06,8.97 47.98,8.97 47.79,8.78 U2.15
  Bottom 0.254: RN1.3 53.64,11.96 53.9,12.22 57.73,12.22 v58.73,11
N$7
  Top 0.305: C4.1 5.69,12.69 U9.4
N$8
  Top 0.254: R6.2 43.64,9.3 44.02,8.91 44.02,7.73 U2.9
N$9
  Top 0.254: R24.2 43.56,11.43 43.97,11.84 43.97,12.97 U2.8
N$10
  Top 0.254: R21.1 RX2.A
N$11  (via drill 0.5, 0.6)
  Top 0.254: R8.2 23.51,14.09 23.37,14.22 | 23.37,14.22 21.97,14.22 U7.4 | 23.37,14.22 23.88,14.73 23.88,19.81 22.8,20.89 U4.9 22.8,24.33 23.62,25.15 25.91,25.15 | 25.91,25.15 27.94,25.15 28.45,24.64 29.83,24.64 U4.17 30.97,24.66 v31.37,24.26 | U4.13 26,22 v26.16,21.84 | v25.91,25.91 25.91,25.15 | v31.88,28.57 31.11,27.81 29.9,27.81 U4.21
  Bottom 0.254: v26.16,21.84 26.16,25.65 v25.91,25.91 | v31.37,24.26 31.37,28.07 v31.88,28.57
N$12
  Top 0.254: R25.2 43.38,20.75 43.99,20.12 43.99,18.83 U3.9
N$13
  Top 0.305: LED2.A 3.63,21.83 R13.2
N$14
  Top 0.254: R26.2 43.36,22.43 43.92,22.99 43.92,24.02 U3.8
N$15  (via drill 0.6)
  Top 0.254: U3.7 44.64,25.11 45.26,25.73 58.09,25.73 | 58.09,25.73 59.49,25.73 60.81,24.41 60.81,22.55 U1.2 | v58.17,26.44 58.17,25.81 58.09,25.73
  Bottom 0.254: RN2.4 55.69,22.06 55.88,21.87 55.88,19.96 56.39,19.46 58.47,19.46 59.13,20.12 59.13,25.48 v58.17,26.44
N$16  (via drill 0.6)
  Top 0.254: U1.3 62.1,20.93 61.59,20.42 58.55,20.42 57.86,21.11 v57.25,21.11 57.35,21.01 57.35,19.68 56.9,19.23 52.25,19.23 51.46,20.02 48.06,20.02 47.82,19.77 U3.15
  Bottom 0.254: RN2.3 51.99,22.88 52.45,23.34 57.07,23.34 57.66,22.76 57.66,21.51 v57.25,21.11
N$17
  Top 0.254: U3.16 50.19,18.82 50.55,18.47 50.55,17.8 SJ2.2
N$18
  Top 0.254: TX3.A 55.98,29.6 R27.1
N$19
  Top 0.254: RX3.A 54.15,29.8 R29.1
N$20
  Top 0.254: U8.9 44.28,32.27 43.79,32.77 42.99,32.77 R30.2
N$21
  Top 0.254: U8.8 44.28,35.12 43.76,34.59 42.96,34.59 R31.2
N$22  (via drill 0.6)
  Top 0.254: U8.7 44.92,37.22 45.39,37.69 50.32,37.69 | 50.32,37.69 52.76,37.69 54,36.45 58.06,36.45 58.47,36.04 58.47,34.19 58.78,33.88 60.58,33.88 60.86,33.6 60.86,31.7 U6.2 | v50.49,38.58 50.49,37.87 50.32,37.69
  Bottom 0.254: RN3.4 54.08,31.91 53.95,31.77 51.05,31.77 50.95,31.88 50.95,35.41 50.37,35.99 50.37,38.46 v50.49,38.58
N$23  (via drill 0.6)
  Top 0.203: U6.3 62.15,31.62 62.15,30.05 61.8,29.69 v58.12,29.69 58.19,29.77 58.19,31.85 57.73,32.31 52.5,32.31 52.35,32.16 48.41,32.16 48.09,31.84 U8.15
  Bottom 0.203: RN3.3 53.28,33.9 53.72,34.34 56.06,34.34 56.36,34.04 58.04,34.04 58.19,33.88 58.19,29.77 v58.12,29.69
N$24
  Top 0.203: U8.16 49.96,30.94 50.37,30.53 50.37,29.58 SJ3.2
N$25
  Top 0.305: R16.2 9.77,4.19 LED3.A
N$28  (via drill 0.5)
  Top 0.254: R28.2 24.64,10.67 24.89,10.92 24.89,13.97 25.15,14.22 | 25.15,14.22 27.05,14.22 U7.5 25.22,14.3 25.15,14.22 | U4.14 26.8,24 26.16,24.64 24.13,24.64 23.62,24.13 23.62,23.23 U4.10 23.62,23.19 23.62,21.08 24.64,20.07 24.64,19.38 | 25.15,14.22 24.64,14.73 24.64,19.38 | U4.22 28.66,28.66 28.45,28.45 28.45,26.31 | U4.18 29.8,25.4 28.7,25.4 28.45,25.65 28.45,26.31 | 28.45,26.31 v28.04,26.31 | v25.48,19.38 24.64,19.38
  Bottom 0.254: v28.04,26.31 28.04,20.75 27.43,20.14 26.29,20.14 v25.48,19.38
N$31
  Top 0.254: TX4.A R33.1
N$32
  Top 0.254: RX4.A R34.1
N$33  (via drill 0.6)
  Top 0.254: TX4.C 50.94,47.91 v50.8,48.06 | v45.59,51 45.57,51 45.41,50.85 45.41,48.04 U11.7
  Bottom 0.254: v50.8,48.06 50.8,50.22 50.44,50.57 46.02,50.57 v45.59,51
N$34
  Top 0.254: RX4.C 48.54,44.48 47.93,43.87 47.93,42.76 U11.14
N$35
  Top 0.254: R35.2 44.2,44.58 44.76,44.02 44.76,42.76 U11.9
N$36
  Top 0.254: R36.2 44.27,46.38 44.76,46.86 44.76,48.02 U11.8
N$37
  Top 0.254: U11.16 50.04,42.75 50.32,42.47 50.32,41.05 SJ4.2
N$38
  Top 0.254: U4.29 R37.1
N$39
  Top 0.254: R37.2 27.01,34.33 27.41,34.72 27.41,37.62 Y1.2
  Bottom 0.254: C31.1 27.3,37.67 Y1.2
N$40
  Top 0.254: U4.30 24.4,33.59 23.98,34.01 22.78,34.01 22.43,34.37 22.43,37.52 Y1.1
  Bottom 0.254: C32.1 22.28,37.67 Y1.1
N$41
  Top 0.254: R3.1 C11.1 15.12,37.34 R4.1 18.11,35.56 18.31,35.36 U5.6 18.34,34.39 18.34,33.6 18.85,33.07 19.58,33.07 20.27,32.38 20.27,30.58 20.59,30.26 U4.1
N$42
  Top 0.254: U4.26 27.6,32.63 28.12,33.15 30.33,33.15 30.79,33.6 30.79,40.92 30.25,41.45 28.7,41.45 28.12,42.04 28.12,43.18 SJ5.2
N$43
  Top 0.254: 16.79,33.78 R7.1 15.15,33.76 C12.1 | 16.79,33.78 16.99,33.78 17.02,33.81 U5.8 | U4.2 19.89,29.46 19.41,29.95 19.41,31.65 19.05,32 17.3,32 16.79,32.54 16.79,33.78
N$44
  Top 0.254: R4.2 9.42,35.56 8.64,34.77 JP9.D+
N$45
  Top 0.254: R7.2 11.61,33.78 JP9.D-
N$46
  Top 0.254: C7.1 R9.2 18.05,26.52 19.15,26.52 19.36,26.72 19.36,27.51 19.7,27.86 U4.4
N$47
  Top 0.254: J2.10 69.17,33.45 68.83,33.78 68.83,37.59 67.56,38.86 62.99,38.86 61.72,40.13 61.72,44.96 57.53,49.15 49.48,49.15 49.21,48.88 U11.1
N$48
  Top 0.254: J2.9 69.71,35.45 69.34,35.81 69.34,37.85 67.82,39.37 63.25,39.37 62.23,40.39 62.23,45.21 57.73,49.71 47.65,49.71 47.31,49.37 U11.4
N$49
  Top 1.016: JP9.VBUS 10.62,25.49 L1.1
N$50
  Bottom 0.813: L2.1 8.54,31.37 JP9.GND
N$51
  Top 0.305: R13.1 6.35,22.61 7.11,23.37 7.87,23.37
  Top 1.016: L1.2 10.41,23.62 9.91,23.11 8.13,23.11 7.87,23.37 8.26,23.37 F1.2
N$52
  Top 0.813: R12.2 76.96,17.02 77.72,16.26 LED1.A
RS485-1-A
  Top 0.254: U19.6 62.1,17.14 62.48,16.76 65.28,16.76 65.79,17.27 65.79,22.35 66.8,23.37 70.83,23.37 J2.15
RS485-1-B
  Top 0.254: U19.7 60.83,16.89 61.47,16.26 65.53,16.26 66.29,17.02 66.29,21.08 66.55,21.34 70.79,21.34 J2.16
RS485-2-A
  Top 0.254: U1.6 62.1,26.29 62.48,25.91 69.09,25.91 69.34,26.16 69.34,27.18 69.6,27.43 70.89,27.43 J2.13
RS485-2-B
  Top 0.254: U1.7 60.83,25.78 61.21,25.4 70.86,25.4 J2.14
RS485-3-A
  Top 0.254: U6.6 62.1,35.43 62.48,35.05 67.06,35.05 68.07,34.04 68.07,32 68.58,31.5 70.86,31.5 J2.11
RS485-3-B
  Top 0.254: U6.7 60.83,35.18 61.47,34.54 66.55,34.54 67.31,33.78 67.31,29.97 67.82,29.46 70.89,29.46 J2.12
RXD0  (via drill 0.6)
  Top 0.254: U2.4 46.52,13.78 46.71,13.97 52.15,13.97 | 52.15,13.97 55.52,13.97 | 55.52,13.97 59.49,13.97 U19.1 | v52.05,13.03 52.05,13.82 52.15,13.97 | RX1.C 55.52,13.97
  Bottom 0.254: RN1.1 52.04,13.07 v52.05,13.03
RXD1  (via drill 0.6)
  Top 0.254: U3.4 46.55,25.01 46.79,25.25 49.86,25.25 | 49.86,25.25 53.24,25.25 | 53.24,25.25 58.78,25.25 59.54,24.49 59.54,22.55 U1.1 | RX2.C 53.34,25.15 53.24,25.25 | v49.96,23.55 49.96,25.15 49.86,25.25
  Bottom 0.254: RN2.1 50.39,23.12 v49.96,23.55
RXD2  (via drill 0.6)
  Top 0.203: RX3.C 54.15,35.87 54.18,35.89
  Top 0.254: U8.4 46.83,37.02 47.02,37.21 51.84,37.21 | 51.84,37.21 52.53,37.21 53.85,35.89 54.18,35.89 57.66,35.89 57.94,35.61 57.94,33.81 58.52,33.22 59.26,33.22 59.56,32.92 U6.1 | v51.69,36.22 51.69,37.06 51.84,37.21
  Bottom 0.254: RN3.1 v51.68,36.21 v51.69,36.22
TXD0  (via drill 0.6)
  Top 0.254: U2.1 50.19,12.98 51.08,12.09 52.7,12.09 v53.62,13.08 53.44,12.83 TX1.C | v64.72,13.46 63.45,13.46 U19.4
  Bottom 0.254: v64.72,13.46 64.14,13.08 v53.62,13.08 52.84,12.22 RN1.2
TXD1  (via drill 0.6)
  Top 0.203: 61.47,21.23 61.47,23.93 61.77,24.23 63.12,24.23 63.4,23.95 63.4,22.55 U1.4 | TX2.C 57.65,24.14 v58.17,23.62
  Top 0.254: U3.1 48.45,22.82 48.84,22.43 51,22.43 51.23,22.66 51.23,23.67 v51.49,23.93 | v58.17,23.62 58.17,21.54 58.78,20.93 61.16,20.93 61.47,21.23
  Bottom 0.203: RN2.2 51.19,23.63 v51.49,23.93
  Bottom 0.254: v51.49,23.93 57.86,23.93 v58.17,23.62
TXD2  (via drill 0.6)
  Top 0.203: U6.4 63.37,33.17 63.12,33.43 61.75,33.43 61.44,33.12 61.44,32.99 61.47,32.97 61.47,30.4 61.29,30.23 59.08,30.23 58.8,30.5 58.8,32.23 57.35,33.68 | 57.35,33.68 57.35,34.49 v56.87,34.98 | TX3.C 57.08,33.41 57.35,33.68
  Top 0.254: U8.1 49.84,36.22 50.98,35.18 52.65,35.18 v52.86,34.98
  Bottom 0.203: v56.87,34.98 v52.86,34.98
  Bottom 0.254: v52.86,34.98 52.76,35.13 52.48,34.85 52.48,32.73 RN3.2
VCC  (via drill 0.5, 0.6)
  Top 0.254: U6.8 59,37.47 58.55,37.47 v58.17,37.85 58.12,37.8 C28.1 | U1.8 58.73,27.76 v58.42,28.07 | v46.71,44.42 46.71,42.84 U11.12 46.74,42.69 46.74,42.24 46.61,42.11 46.61,41.73 46.8,41.54 C29.1 | U2.12 45.88,6.18 46.18,5.89 C3.1 | C5.1 46.35,16.89 45.92,17.32 45.92,18.81 U3.12 45.91,20.1 v45.64,20.37 | C2.1 59.61,16.18 v59.82,16.38 | C23.1 46.5,29.2 46.2,29.49 46.2,30.92 U8.12 46.18,30.95 46.18,32.41 46.41,32.64 v46.53,32.74
  Top 0.305: v46.18,9.53 46.15,9.53 45.87,9.25 45.87,7.71 U2.12
  Top 0.406: U19.8 59.56,16.64 v59.82,16.38
  Top 0.813: 27.25,17.98 U7.8 U7.7 | U7.6 U7.7 | v29.08,17.8 v29.08,16.79 | v29.13,15.62 29.13,16.51 29.11,16.54 29.11,17.65 29.06,17.7 28.02,17.7 27.89,17.58 27.89,16.13 27.84,16.08 27.84,15.95 28.14,15.65 28.6,15.65 28.6,17.25 28.57,17.27 27.56,17.27 U7.7
  Bottom 0.254: 59.82,28.19 59.69,28.07 v58.42,28.07 C22.1 | 39.12,41.27 46.15,41.27 46.74,41.86 46.74,44.4 v46.71,44.42 | v45.64,20.37 45.64,16.48 45.19,16.03 39.14,16.03 39.12,16 | 39.12,29.72 45.67,29.72 46.2,30.25 46.2,32.41 v46.53,32.74
  Bottom 0.305: 39.12,7.11 45.3,7.11 U2.12 45.88,9.23 v46.18,9.53
  Bottom 0.406: v59.82,16.38 59.82,28.19 59.82,37.08 59.44,37.47 58.55,37.47 v58.17,37.85 58.14,37.87 58.14,38.94 57.23,39.85 39.29,39.85 39.14,39.7 39.14,39.52 39.12,39.5
  Bottom 0.813: JP4.1 38.61,41.78 39.12,41.27 39.12,39.5 39.12,29.72 | 39.12,29.72 39.12,18.03 | 39.12,18.03 39.12,16 39.12,7.11 38.35,6.35 JP2.1 | 39.12,18.03 39.06,17.98 JP1.1 29.26,17.98 v29.08,17.8 | JP3.1 38.94,29.9 39.12,29.72 | v29.08,16.79 29.08,17.7 29.13,17.75 v29.13,15.62

### Text on the board
tPlace: Debug Unit | RJ
_tsilk: C39 | U11 | TX4 | R33 | Debug Unit | R36 | SJ5 | R35 | RX4 | R34 | SJ4 | JP9 | Y1 | C38 | C19 | C30 | C28 | C29 | J2 | C11 | R3 | R31 | R4 | U5 | R37 | U8 | U6 | SJ3 | U4 | R30 | RX3 | TX3 | R7 | R29 | RJ | C12 | C18 | C17 | C16 | C23 | R27 | R26 | L1 | U1 | R13 | R9 | TX2 | RX2 | + | C7 | U3 | LED2 | R21 | F1 | R5 | C36 | U7 | C33 | R25 | C34 | U19 | C9 | C10 | C6 | SJ2 | R12 | C5 | LED1 | C2 | R8 | R24 | U9 | U2 | C4 | R28 | RX1 | S1 | TX1 | C35 | R6 | SJ1 | R2 | + | C8 | C1 | C3 | R1 | R16 | LED3
_bsilk: R23 | R22 | C32 | C31 | R19 | RN3 | L2 | R18 | C22 | R15 | RN2 | R14 | R11 | RN1 | R10